# EAGLE design control_board (EAGLE 6.6.0)
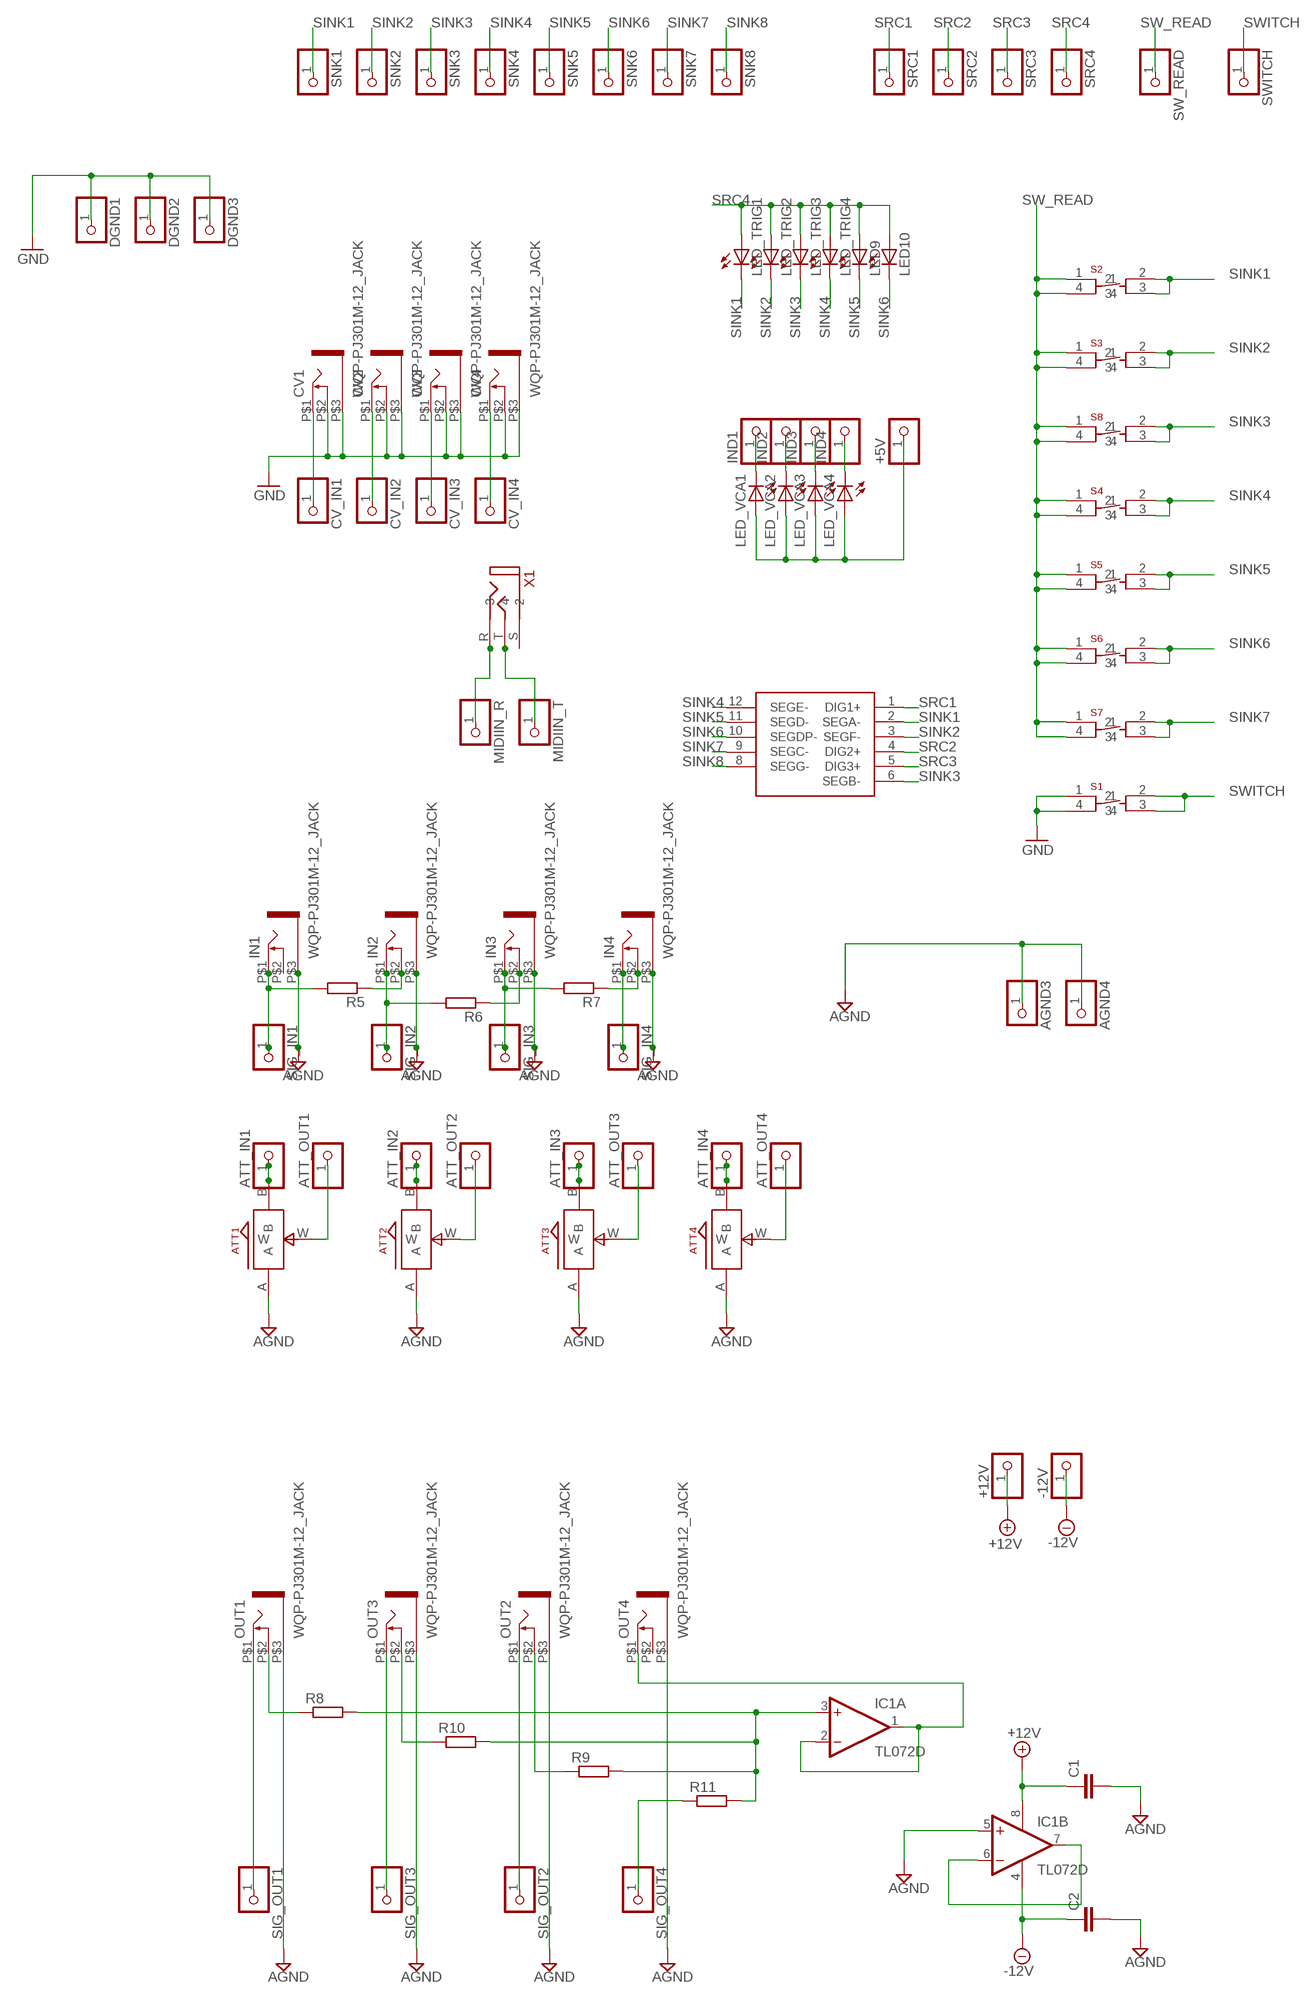
[diagram p0: schematic, sheet 1]

## Parts
+5V  PINHD-1X1  [1X01]
+12V  PINHD-1X1  [1X01]
-12V  PINHD-1X1  [1X01]
AGND3  PINHD-1X1  [1X01]
AGND4  PINHD-1X1  [1X01]
ATT1  ALPS_POT_SMALL  [SMALL_ALPS_POT]
ATT2  ALPS_POT_SMALL  [SMALL_ALPS_POT]
ATT3  ALPS_POT_SMALL  [SMALL_ALPS_POT]
ATT4  ALPS_POT_SMALL  [SMALL_ALPS_POT]
ATT_IN1  PINHD-1X1  [1X01]
ATT_IN2  PINHD-1X1  [1X01]
ATT_IN3  PINHD-1X1  [1X01]
ATT_IN4  PINHD-1X1  [1X01]
ATT_OUT1  PINHD-1X1  [1X01]
ATT_OUT2  PINHD-1X1  [1X01]
ATT_OUT3  PINHD-1X1  [1X01]
ATT_OUT4  PINHD-1X1  [1X01]
C1  C-EUC0805  [C0805]
C2  C-EUC0805  [C0805]
CV1  WQP-PJ301M-12_JACK  [WQP-PJ301M-12_JACK]
CV2  WQP-PJ301M-12_JACK  [WQP-PJ301M-12_JACK]
CV3  WQP-PJ301M-12_JACK  [WQP-PJ301M-12_JACK]
CV4  WQP-PJ301M-12_JACK  [WQP-PJ301M-12_JACK]
CV_IN1  PINHD-1X1  [1X01]
CV_IN2  PINHD-1X1  [1X01]
CV_IN3  PINHD-1X1  [1X01]
CV_IN4  PINHD-1X1  [1X01]
DGND1  PINHD-1X1  [1X01]
DGND2  PINHD-1X1  [1X01]
DGND3  PINHD-1X1  [1X01]
DISP1  KYX2381_TRIPLE7SEG  [KYX2381_TRIPLE7SEG]
IC1  TL072D  [SO08]
IN1  WQP-PJ301M-12_JACK  [WQP-PJ301M-12_JACK]
IN2  WQP-PJ301M-12_JACK  [WQP-PJ301M-12_JACK]
IN3  WQP-PJ301M-12_JACK  [WQP-PJ301M-12_JACK]
IN4  WQP-PJ301M-12_JACK  [WQP-PJ301M-12_JACK]
IND1  PINHD-1X1  [1X01]
IND2  PINHD-1X1  [1X01]
IND3  PINHD-1X1  [1X01]
IND4  PINHD-1X1  [1X01]
LED9  LED3MM  [LED3MM]
LED10  LED3MM  [LED3MM]
LED_TRIG1  LED3MM  [LED3MM]
LED_TRIG2  LED3MM  [LED3MM]
LED_TRIG3  LED3MM  [LED3MM]
LED_TRIG4  LED3MM  [LED3MM]
LED_VCA1  LED3MM  [LED3MM]
LED_VCA2  LED3MM  [LED3MM]
LED_VCA3  LED3MM  [LED3MM]
LED_VCA4  LED3MM  [LED3MM]
MIDIIN_R  PINHD-1X1  [1X01]
MIDIIN_T  PINHD-1X1  [1X01]
OUT1  WQP-PJ301M-12_JACK  [WQP-PJ301M-12_JACK]
OUT2  WQP-PJ301M-12_JACK  [WQP-PJ301M-12_JACK]
OUT3  WQP-PJ301M-12_JACK  [WQP-PJ301M-12_JACK]
OUT4  WQP-PJ301M-12_JACK  [WQP-PJ301M-12_JACK]
R5  R-EU_R0805  [R0805]
R6  R-EU_R0805  [R0805]
R7  R-EU_R0805  [R0805]
R8  R-EU_R0805  [R0805]
R9  R-EU_R0805  [R0805]
R10  R-EU_R0805  [R0805]
R11  R-EU_R0805  [R0805]
S1  6MM_TACT  [6MMTACT]
S2  6MM_TACT  [6MMTACT]
S3  6MM_TACT  [6MMTACT]
S4  6MM_TACT  [6MMTACT]
S5  6MM_TACT  [6MMTACT]
S6  6MM_TACT  [6MMTACT]
S7  6MM_TACT  [6MMTACT]
S8  6MM_TACT  [6MMTACT]
SIG_IN1  PINHD-1X1  [1X01]
SIG_IN2  PINHD-1X1  [1X01]
SIG_IN3  PINHD-1X1  [1X01]
SIG_IN4  PINHD-1X1  [1X01]
SIG_OUT1  PINHD-1X1  [1X01]
SIG_OUT2  PINHD-1X1  [1X01]
SIG_OUT3  PINHD-1X1  [1X01]
SIG_OUT4  PINHD-1X1  [1X01]
SNK1  PINHD-1X1  [1X01]
SNK2  PINHD-1X1  [1X01]
SNK3  PINHD-1X1  [1X01]
SNK4  PINHD-1X1  [1X01]
SNK5  PINHD-1X1  [1X01]
SNK6  PINHD-1X1  [1X01]
SNK7  PINHD-1X1  [1X01]
SNK8  PINHD-1X1  [1X01]
SRC1  PINHD-1X1  [1X01]
SRC2  PINHD-1X1  [1X01]
SRC3  PINHD-1X1  [1X01]
SRC4  PINHD-1X1  [1X01]
SW_READ  PINHD-1X1  [1X01]
SWITCH  PINHD-1X1  [1X01]
X1  VERTICAL_3_5MM_SOCKETTHONK  [PJ301CM]

## Nets
+5V: +5V.1 LED_VCA1.A LED_VCA2.A LED_VCA3.A LED_VCA4.A
+12V: +12V.1 C1.1 IC1.8(P:V+)
-12V: -12V.1 C2.1 IC1.4(P:V-)
AGND: AGND3.1 AGND4.1 ATT1.A ATT2.A ATT3.A ATT4.A C1.2 C2.2 IC1.5(B:+IN) IN1.P$3 IN2.P$3 IN3.P$3 IN4.P$3 OUT1.P$3 OUT2.P$3 OUT3.P$3 OUT4.P$3
GND: CV1.P$2 CV1.P$3 CV2.P$2 CV2.P$3 CV3.P$2 CV3.P$3 CV4.P$2 CV4.P$3 DGND1.1 DGND2.1 DGND3.1 S1.1 S1.4
N$1: ATT1.W ATT_OUT1.1
N$2: ATT1.B ATT_IN1.1
N$3: ATT3.W ATT_OUT3.1
N$4: ATT2.B ATT_IN2.1
N$5: ATT2.W ATT_OUT2.1
N$6: ATT3.B ATT_IN3.1
N$7: ATT4.W ATT_OUT4.1
N$8: ATT4.B ATT_IN4.1
N$9: OUT1.P$2 R8.1
N$10: IN2.P$1 R6.2 SIG_IN2.1
N$11: IN3.P$1 R7.2 SIG_IN3.1
N$12: IN4.P$1 SIG_IN4.1
N$13: CV1.P$1 CV_IN1.1
N$14: CV2.P$1 CV_IN2.1
N$15: CV3.P$1 CV_IN3.1
N$16: CV4.P$1 CV_IN4.1
N$18: OUT1.P$1 SIG_OUT1.1
N$19: MIDIIN_R.1 X1.R
N$20: MIDIIN_T.1 X1.T
N$21: IND1.1 LED_VCA1.K(C)
N$22: IND2.1 LED_VCA2.K(C)
N$23: IND3.1 LED_VCA3.K(C)
N$24: IND4.1 LED_VCA4.K(C)
N$26: OUT3.P$1 SIG_OUT3.1
N$27: OUT2.P$1 SIG_OUT2.1
N$28: R11.1 SIG_OUT4.1
N$34: IN2.P$2 R5.1
N$35: IN3.P$2 R6.1
N$36: IN4.P$2 R7.1
N$37: IN1.P$1 R5.2 SIG_IN1.1
N$38: OUT3.P$2 R10.1
N$39: OUT2.P$2 R9.1
N$42: IC1.3(A:+IN) R8.2 R9.2 R10.2 R11.2
N$44: IC1.1(A:OUT) IC1.2(A:-IN) OUT4.P$1
N$46: IC1.6(B:-IN) IC1.7(B:OUT)
SINK1: DISP1.2(SEGA-) LED_TRIG1.K(C) S2.2 S2.3 SNK1.1
SINK2: DISP1.3(SEGF-) LED_TRIG2.K(C) S3.2 S3.3 SNK2.1
SINK3: DISP1.6(SEGB-) LED_TRIG3.K(C) S8.2 S8.3 SNK3.1
SINK4: DISP1.12(SEGE-) LED_TRIG4.K(C) S4.2 S4.3 SNK4.1
SINK5: DISP1.11(SEGD-) LED9.K(C) S5.2 S5.3 SNK5.1
SINK6: DISP1.10(SEGDP-) LED10.K(C) S6.2 S6.3 SNK6.1
SINK7: DISP1.9(SEGC-) S7.2 S7.3 SNK7.1
SINK8: DISP1.8(SEGG-) SNK8.1
SRC1: DISP1.1(DIG1+) SRC1.1
SRC2: DISP1.4(DIG2+) SRC2.1
SRC3: DISP1.5(DIG3+) SRC3.1
SRC4: LED9.A LED10.A LED_TRIG1.A LED_TRIG2.A LED_TRIG3.A LED_TRIG4.A SRC4.1
SW_READ: S2.1 S2.4 S3.1 S3.4 S4.1 S4.4 S5.1 S5.4 S6.1 S6.4 S7.1 S7.4 S8.1 S8.4 SW_READ.1
SWITCH: S1.2 S1.3 SWITCH.1
Unconnected: IN1.P$2 OUT4.P$2 X1.S

## Library data of the parts
+5V +12V -12V AGND3 AGND4 ATT_IN1-ATT_IN4 ATT_OUT1-ATT_OUT4 CV_IN1-CV_IN4 DGND1-DGND3 IND1-IND4 MIDIIN_R MIDIIN_T SIG_IN1-SIG_IN4 SIG_OUT1-SIG_OUT4 SNK1-SNK8 SRC1-SRC4 SW_READ SWITCH = pinhead:PINHD-1X1: PIN HEADER
ATT1-ATT4 = jasons_stuff:ALPS_POT_SMALL
C1 C2 = rcl:C-EU: CAPACITOR, European symbol
CV1-CV4 IN1-IN4 OUT1-OUT4 = thonkiconn:WQP-PJ301M-12_JACK
DISP1 = jason_eagle6:KYX2381_TRIPLE7SEG
IC1 = linear:TL072: OP AMP
LED9 LED10 LED_TRIG1-LED_TRIG4 LED_VCA1-LED_VCA4 = led:LED: LED OSRAM: - CHIPLED LG R971, LG N971, LY N971, LG Q971, LY Q971, LO R971, LY R971 LH N974, LH R974 LS Q976, LO Q976, LY Q976 LO Q996 - Hyper CHIPLED LW Q18S LB Q993, LB Q99A, LB R99A - SideLED LS A670, LO A670, LY A670, LG A670, LP A670 LB A673, LV A673, LT A673, LW A673 LH A674 LY A675 LS A676, LA A676, LO A676, LY A676, LW A676 LS A679, LY A679, LG A679 - Hyper Micro SIDELED® LS Y876, LA Y876, LO Y876, LY Y876 LT Y87S - SmartLED LW L88C, LW L88S LB L89C, LB L89S, LG L890 LS L89K, LO L89K, LY L89K LS L896, LA L896, LO L896, LY L896 - TOPLED LS T670, LO T670, LY T670, LG T670, LP T670 LSG T670, LSP T670, LSY T670, LOP T670, LYG T670 LG T671, LOG T671, LSG T671 LB T673, LV T673, LT T673, LW T673 LH T674 LS T676, LA T676, LO T676, LY T676, LB T676, LH T676, LSB T676, LW T676 LB T67C, LV T67C, LT T67C, LS T67K, LO T67K, LY T67K, LW E67C LS E67B, LA E67B, LO E67B, LY E67B, LB E67C, LV E67C, LT E67C LW T67C LS T679, LY T679, LG T679 LS T770, LO T770, LY T770, LG T770, LP T770 LB T773, LV T773, LT T773, LW T773 LH T774 LS E675, LA E675, LY E675, LS T675 LS T776, LA T776, LO T776, LY T776, LB T776 LHGB T686 LT T68C, LB T68C - Hyper Mini TOPLED® LB M676 - Mini TOPLED Santana® LG M470 LS M47K, LO M47K, LY M47K Source: http://www.osram.convergy.de LUXEON: - LUMILED® LXK2-PW12-R00, LXK2-PW12-S00, LXK2-PW14-U00, LXK2-PW14-V00 LXK2-PM12-R00, LXK2-PM12-S00, LXK2-PM14-U00 LXK2-PE12-Q00, LXK2-PE12-R00, LXK2-PE12-S00, LXK2-PE14-T00, LXK2-PE14-U00 LXK2-PB12-K00, LXK2-PB12-L00, LXK2-PB12-M00, LXK2-PB14-N00, LXK2-PB14-P00, LXK2-PB14-Q00 LXK2-PR12-L00, LXK2-PR12-M00, LXK2-PR14-Q00, LXK2-PR14-R00 LXK2-PD12-Q00, LXK2-PD12-R00, LXK2-PD12-S00 LXK2-PH12-R00, LXK2-PH12-S00 LXK2-PL12-P00, LXK2-PL12-Q00, LXK2-PL12-R00 Source: www.luxeon.com KINGBRIGHT: KA-3528ASYC Source: www.kingbright.com
R5-R11 = rcl:R-EU_: RESISTOR, European symbol
S1-S8 = jason_eagle6:6MM_TACT
X1 = jason_eagle6:VERTICAL_3_5MM_SOCKET

## Board
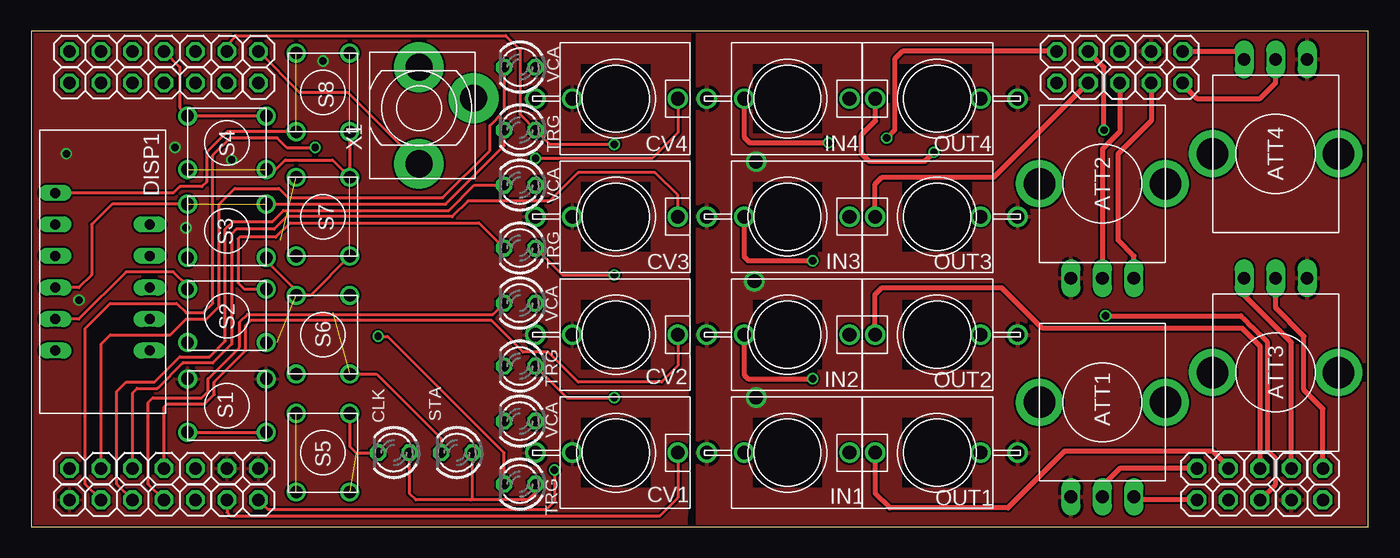
[diagram p1: board, top side]
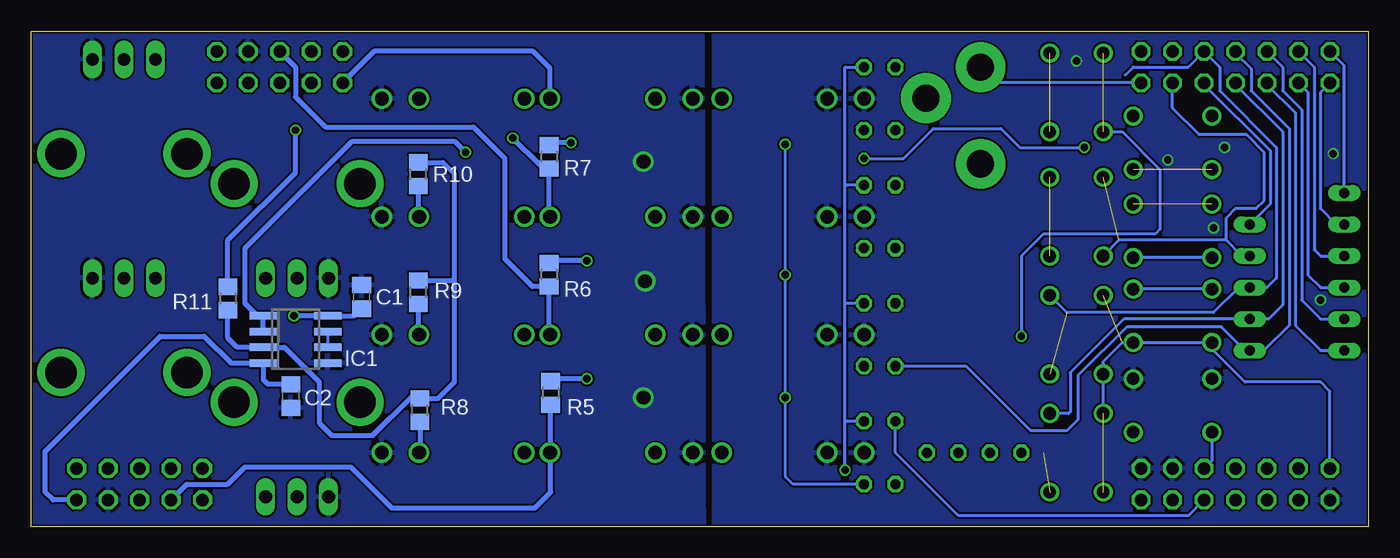
[diagram p2: board, bottom side, seen from below]

Size 107.84 x 39.98 mm. Coordinates in mm from the lower left corner, seen from the top.
Outline: 107.84,0 107.84,39.98 0,39.98 0,0 107.84,0
Copper layers (1*16): Top 0.035mm / dielectric 1.5mm / Bottom 0.035mm
Design rules "hackvana": minimum track width 6mil, minimum drill 0.3mm, track to track 6mil, track to pad 9mil, pad to pad 6mil, via to via 6mil, smd to smd 0mil, copper to edge 6mil, drill to drill 6mil, minimum pad ring 10mil, minimum via ring 6mil, stop-mask expansion 2mil, vias tented up to drill 100mil, thermal gap 10mil

### Footprints (pad centres in the part's own frame; a part is rotated, then mirrored left to right if it is on the bottom)
1X01 = drill 1.016 octagon: 1 0,0
SMALL_ALPS_POT = drill 1.016 long: A -2.54,-7.62; B 2.54,-7.62; W 0,-7.62 | drill 2.54 pad 3.81: GND@1 -5.08,0; GND@2 5.08,0
C0805 = smd 1.3 x 1.5: 1 -0.95,0; 2 0.95,0
WQP-PJ301M-12_JACK = drill 1.1: P$1 0,5; P$2 0,-3.5; P$3 0,-6.5
KYX2381_TRIPLE7SEG = drill 0.8 long: 1 5.08,8.89; 2 7.62,8.89; 3 10.16,8.89; 4 12.7,8.89; 5 15.24,8.89; 6 17.78,8.89; 8 15.24,1.27; 9 12.7,1.27; 10 10.16,1.27; 11 7.62,1.27; 12 5.08,1.27
SO08 = smd 0.6 x 2.2: 1 -1.905,-2.6; 2 -0.635,-2.6; 3 0.635,-2.6; 4 1.905,-2.6; 5 1.905,2.6; 6 0.635,2.6; 7 -0.635,2.6; 8 -1.905,2.6
LED3MM = drill 0.813 octagon: A -1.27,0; K 1.27,0
R0805 = smd 1.3 x 1.5: 1 -0.95,0; 2 0.95,0
6MMTACT = drill 1.016: 1 -3.175,2.159; 2 -3.175,-2.159; 3 3.175,-2.159; 4 3.175,2.159
PJ301CM = drill 2.2 pad 4: R 0,3.3; S 4.4,0.8; T 0,-4.5

### Placement (x,y rotation side)
+5V  18.31,2.16 0 top
+12V  99.08,2.16 0 top
-12V  104.16,2.16 0 top
AGND3  90.32,38.35 90 top
AGND4  101.62,2.16 90 top
ATT1  86.38,10.03 0 top
ATT2  86.38,27.69 0 top
ATT3  100.35,12.45 180 top
ATT4  100.35,30.1 180 top
ATT_IN1  94,2.16 90 top
ATT_IN2  90.32,35.81 90 top
ATT_IN3  101.62,4.7 90 top
ATT_IN4  92.86,38.35 90 top
ATT_OUT1  94,4.7 90 top
ATT_OUT2  87.78,35.81 90 top
ATT_OUT3  104.16,4.7 90 top
ATT_OUT4  92.86,35.81 90 top
C1  81.17,18.54 90 bottom
C2  86.89,10.54 270 bottom
CV1  47.14,5.97 270 top
CV2  47.14,15.49 270 top
CV3  47.14,25.02 270 top
CV4  47.14,34.54 270 top
CV_IN1  15.77,2.16 90 top
CV_IN2  10.69,4.7 90 top
CV_IN3  8.15,4.7 90 top
CV_IN4  5.61,2.16 90 top
DGND1  18.31,4.7 0 top
DGND2  3.07,2.16 0 top
DGND3  15.77,4.7 0 top
DISP1  10.81,9.14 90 top
IC1  86.51,15.11 270 bottom
IN1  60.98,5.97 270 top
IN2  60.98,15.49 270 top
IN3  60.98,25.02 270 top
IN4  60.98,34.54 270 top
IND1  13.23,2.16 0 top
IND2  10.69,2.16 0 top
IND3  8.15,2.16 0 top
IND4  5.61,4.7 0 top
LED9  29.23,5.97 180 top
LED10  34.31,5.97 180 top
LED_TRIG1  39.39,22.48 180 top
LED_TRIG2  39.39,32 180 top
LED_TRIG3  39.39,3.43 180 top
LED_TRIG4  39.39,12.95 180 top
LED_VCA1  39.39,8.51 180 top
LED_VCA2  39.39,18.03 180 top
LED_VCA3  39.39,27.56 180 top
LED_VCA4  39.39,37.08 180 top
MIDIIN_R  18.31,35.81 90 top
MIDIIN_T  18.31,38.35 90 top
OUT1  73.04,5.97 90 top
OUT2  73.04,15.49 90 top
OUT3  73.04,25.02 90 top
OUT4  73.04,34.54 90 top
R5  65.93,10.8 270 bottom
R6  66.06,20.32 270 bottom
R7  66.06,29.84 270 bottom
R8  76.47,9.4 90 bottom
R9  76.6,18.92 90 bottom
R10  76.6,28.45 90 bottom
R11  91.97,18.41 270 bottom
S1  15.77,9.78 0 top
S2  15.77,17.02 180 top
S3  15.77,23.88 180 top
S4  15.77,30.99 180 top
S5  23.51,5.97 90 top
S6  23.51,15.49 90 top
S7  23.51,25.02 270 top
S8  23.51,35.05 270 top
SIG_IN1  96.54,2.16 270 top
SIG_IN2  87.78,38.35 270 top
SIG_IN3  82.7,38.35 90 top
SIG_IN4  82.7,35.81 90 top
SIG_OUT1  96.54,4.7 90 top
SIG_OUT2  99.08,4.7 90 top
SIG_OUT3  85.24,35.81 90 top
SIG_OUT4  85.24,38.35 0 top
SNK1  8.15,38.35 0 top
SNK2  5.61,35.81 0 top
SNK3  3.07,38.35 0 top
SNK4  10.69,38.35 0 top
SNK5  10.69,35.81 0 top
SNK6  13.23,38.35 0 top
SNK7  15.77,35.81 0 top
SNK8  13.23,35.81 0 top
SRC1  8.15,35.81 0 top
SRC2  5.61,38.35 0 top
SRC3  3.07,35.81 0 top
SRC4  15.77,38.35 0 top
SW_READ  3.07,4.7 0 top
SWITCH  13.23,4.7 0 top
X1  31.26,33.78 0 top

### Tracks (layer width: path | path; a pad name or v marks a point on that pad's centre or on a via)
+5V  (via drill 0.6)
  Top 0.254: v42.18,4.57 42.18,2.03 41.55,1.4 19.07,1.4 +5V.1
  Bottom 0.254: LED_VCA1.A 42.06,8.51 42.18,8.38 | 42.18,8.38 42.18,18.03 | 42.18,18.03 42.18,27.69 | 42.18,27.69 42.18,37.08 LED_VCA4.A | LED_VCA3.A 42.06,27.56 42.18,27.69 | LED_VCA2.A 42.18,18.03 | v42.18,4.57 42.18,8.38
+12V  (via drill 0.6 pad 0.61)
  Top 0.406: +12V.1 100.35,3.43 100.35,5.46 99.71,6.1 99.71,14.86 98.44,16.13 97.81,16.76 97.55,17.02 v86.63,17.02
  Bottom 0.406: C1.1 81.75,17.02 IC1.8 v86.63,17.02
-12V
  Bottom 0.406: C2.1 88.73,11.49 89.11,11.87 IC1.4 91.71,13.21 93.87,15.37 97.43,15.37 106.7,6.1 106.7,2.79 106.06,2.16 -12V.1
AGND  (via drill 1.1)
  other vias: 58.44,29.46 58.31,19.81 58.44,10.41
  pour Bottom: 53.74,42.29 53.61,-6.6 109.24,-4.83 109.24,42.16
  pour Top: 53.74,40.77 53.74,-4.95 113.05,-4.83 113.05,45.97 55.9,45.97
GND  (via drill 0.6)
  other vias: 23.51,37.59 16.15,29.59 11.58,30.61 2.81,30.1 12.46,24.13 3.83,18.29
  pour Bottom: -4.55,42.8 -4.55,-2.29 52.72,-2.29 52.72,42.8
  pour Top: -5.06,42.16 -5.06,-2.29 52.85,-2.29 53.1,42.29 -4.81,42.29
N$1
  Top 0.406: ATT_OUT1.1 87.78,4.7 86.38,3.3 ATT1.W
N$2
  Top 0.406: ATT_IN1.1 89.17,2.16 ATT1.B
N$3
  Top 0.406: ATT_OUT3.1 104.16,9.52 102.63,11.05 102.63,15.37 100.35,17.65 ATT3.W
N$4
  Top 0.406: ATT2.B 88.92,21.84 87.65,23.11 87.65,30.1 90.32,32.77 ATT_IN2.1
N$5
  Top 0.406: ATT_OUT2.1 87.78,31.88 86.38,30.48 ATT2.W
N$6
  Top 0.406: ATT_IN3.1 101.62,14.86 97.81,18.67 ATT3.B
N$7
  Top 0.406: ATT_OUT4.1 92.86,35.69 94,34.54 99.08,34.54 100.35,35.81 ATT4.W
N$8
  Top 0.406: ATT_IN4.1 97.17,38.35 ATT4.B
N$9
  Bottom 0.406: R8.1 76.47,6.04 OUT1.P$2
N$10
  Bottom 0.406: SIG_IN2.1 86.51,37.08 86.51,34.67 84.09,32.26 72.15,32.26 69.61,29.72 69.61,21.59 67.39,19.37 R6.2 66.06,15.49 IN2.P$1
N$11  (via drill 0.6 pad 0.61)
  Top 0.406: SIG_IN3.1 70.25,38.35 69.61,37.72 69.61,32 v68.98,31.37
  Bottom 0.406: IN3.P$1 66.06,25.02 R7.2 66.37,29.21 66.82,29.21 v68.98,31.37
N$12
  Bottom 0.406: IN4.P$1 65.98,37 67.33,38.35 80.16,38.35 SIG_IN4.1
N$13
  Top 0.254: CV_IN1.1 15.77,1.14 16.02,0.89 50.69,0.89 52.14,2.33 CV1.P$1
N$14
  Top 0.254: CV_IN2.1 10.69,9.65 10.94,9.91 13.99,9.91 14.75,10.67 14.75,11.68 17.29,14.22 17.29,16.26 17.67,16.64 37.1,16.64 39.64,14.1 41.67,14.1 44.09,11.68 50.82,11.68 52.14,13 CV2.P$1
N$15
  Top 0.254: CV_IN3.1 8.15,10.8 8.53,11.18 10.18,11.18 12.21,13.21 14.62,13.21 16.15,14.73 16.15,23.62 16.53,24 19.58,24 20.59,25.02 33.93,25.02 35.2,26.29 41.8,26.29 44.09,28.57 50.31,28.57 52.14,26.75 CV3.P$1
N$16  (via drill 0.6)
  Top 0.254: CV_IN4.1 4.34,3.43 4.34,16 6.37,18.03 11.7,18.03 12.46,17.27 13.86,17.27 14.62,18.03 14.62,29.97 16.02,31.37 19.83,31.37 20.59,30.61 v22.88,30.61 | CV4.P$1 52.14,31.8 50.06,29.72 v40.66,29.72
  Bottom 0.254: v22.88,30.61 28.09,30.61 29.61,32.13 35.07,32.13 37.48,29.72 v40.66,29.72
N$18
  Top 0.406: SIG_OUT1.1 96.54,4.83 95.27,6.1 83.33,6.1 78.76,1.52 69.23,1.52 68.04,2.71 OUT1.P$1
N$19
  Bottom 0.254: MIDIIN_R.1 29.99,35.81 X1.R
N$20
  Top 0.254: MIDIIN_T.1 21.61,35.05 25.49,35.05 X1.T
N$21
  Bottom 0.254: IND1.1 14.5,0.89 33.04,0.89 38.12,5.97 LED_VCA1.K
N$22
  Top 0.254: IND2.1 9.42,3.43 9.42,10.03 9.8,10.41 13.73,10.41 14.24,10.92 14.24,11.94 16.78,14.48 16.78,16.51 17.42,17.14 37.23,17.14 LED_VCA2.K
N$23
  Top 0.254: IND3.1 6.88,3.43 6.88,10.92 7.64,11.68 9.92,11.68 11.96,13.72 14.37,13.72 15.64,14.99 15.64,24 16.27,24.64 19.45,24.64 20.34,25.53 33.67,25.53 35.71,27.56 LED_VCA3.K
N$24
  Top 0.254: IND4.1 5.61,14.73 6.37,15.49 11.19,15.49 12.46,16.76 14.12,16.76 15.13,17.78 15.13,26.03 16.4,27.3 19.96,27.3 20.72,26.54 33.17,26.54 36.98,30.35 36.98,32.39 38.12,33.53 LED_VCA4.K
N$26
  Top 0.406: OUT3.P$1 68.04,27.64 68.6,28.19 77.62,28.19 SIG_OUT3.1
N$27
  Top 0.406: OUT2.P$1 68.04,18.75 68.6,19.3 78.25,19.3 81.55,16 97.68,16 99.08,14.6 SIG_OUT2.1
N$28  (via drill 0.6 pad 0.61)
  Top 0.406: v86.51,32 86.51,37.08 SIG_OUT4.1
  Bottom 0.406: R11.1 91.97,23.11 86.51,28.57 v86.51,32
N$34  (via drill 0.6)
  Top 0.406: IN2.P$2 57.48,12.26 57.8,11.94 v63.01,11.94
  Bottom 0.406: v63.01,11.94 65.74,11.94 R5.1
N$35  (via drill 0.6)
  Top 0.406: IN3.P$2 57.48,21.79 57.8,21.46 v63.01,21.46
  Bottom 0.406: v63.01,21.46 65.87,21.46 R6.1
N$36  (via drill 0.6 pad 0.61)
  Top 0.406: IN4.P$2 57.48,31.44 57.93,30.99 v64.28,30.99
  Bottom 0.406: 65.74,31.11 R7.1 65.87,30.99 v64.28,30.99
N$37
  Bottom 0.406: SIG_IN1.1 95.27,3.43 91.97,3.43 90.57,4.83 82.06,4.83 78.76,1.52 67.2,1.52 65.93,2.79 65.93,5.92 IN1.P$1 65.93,5.97 R5.2
N$38
  Bottom 0.406: R10.1 76.6,25.07 OUT3.P$2
N$39
  Bottom 0.406: R9.1 76.6,15.55 OUT2.P$2
N$42
  Bottom 0.406: R11.2 91.97,15.24 91.2,14.48 IC1.3 87.39,14.48 84.6,11.68 84.6,8.38 83.58,7.37 80.28,7.37 77.23,10.41 76.54,10.41 R8.2 75.01,10.35 73.68,11.68 73.68,19.81 | 73.68,19.81 73.68,28.45 74.63,29.4 R10.2 | R9.2 73.74,19.87 73.68,19.81
N$44  (via drill 0.6 pad 0.61)
  Top 0.406: v72.79,30.23 72.03,29.46 67.58,29.46 66.95,30.1 66.95,31.62 68.09,32.77 68.09,34.5 OUT4.P$1
  Bottom 0.406: IC1.2 IC1.1 89.55,17.02 90.57,18.03 90.57,22.48 81.93,31.11 73.68,31.11 v72.79,30.23
N$46
  Bottom 0.254: IC1.7 IC1.6
SINK1
  Top 0.254: DISP1.2 3.83,16.76 7.64,20.57 11.45,20.57 12.59,19.43 S2.3 | S2.2 17.16,19.18 16.66,19.68 16.66,23.24 16.78,23.37 19.7,23.37 20.85,24.51 36.09,24.51 LED_TRIG1.K
  Bottom 0.254: SNK1.1 6.88,37.08 6.88,35.18 5.35,33.66 5.35,18.29 3.83,16.76 DISP1.2 | S2.3 S2.2
SINK2  (1 unrouted)
  Top 0.254: S3.3 6.5,26.03 4.84,24.38 4.84,20.32 3.83,19.3 DISP1.3 | S3.2 33.42,26.03 38.12,30.73 LED_TRIG2.K
  Bottom 0.254: SNK2.1 4.84,35.05 4.84,20.32 3.83,19.3 DISP1.3
SINK3  (via drill 0.6)  (1 unrouted)
  Top 0.254: S8.3 15.77,31.88 14.12,30.23 14.12,27.81 13.73,27.43 11.96,27.43 11.45,26.92 DISP1.6 | v27.96,15.37 28.72,15.37 38.12,5.97 LED_TRIG3.K
  Bottom 0.254: DISP1.6 1.92,37.21 SNK3.1 | S8.3 19.83,31.88 16.78,28.83 16.78,24 17.16,23.62 26.18,23.62 27.96,21.84 v27.96,15.37
SINK4
  Top 0.254: SNK4.1 11.96,37.08 11.96,33.78 S4.3 | S4.3 12.72,33.27 | S4.2 S4.3
  Bottom 0.254: 19.07,33.27 S4.2 | SNK4.1 10.69,38.23 9.42,36.96 9.42,35.18 6.37,32.13 6.37,16.26 8.4,14.22 DISP1.12 9.92,14.22 11.83,16.13 19.45,16.13 23.39,12.19 23.39,8.64 24.28,7.75 27.2,7.75 32.4,12.95 LED_TRIG4.K
SINK5  (1 unrouted)
  Top 0.254: S5.3 25.67,6.48 26.18,5.97 LED9.K
  Bottom 0.254: SNK5.1 10.69,35.69 6.88,31.88 6.88,17.91 8.02,16.76 DISP1.11 19.7,16.76 24.02,12.45 24.02,9.27 24.15,9.14 S5.3
SINK6  (1 unrouted)
  Top 0.254: S6.2 27.83,12.32 33.04,7.11 LED10.K
  Bottom 0.254: 19.58,36.45 18.94,37.08 14.5,37.08 SNK6.1 11.96,37.08 11.96,35.18 7.38,30.61 7.38,20.07 8.15,19.3 DISP1.10 10.43,19.3 12.46,17.27 24.28,17.27 S6.3
SINK7  (1 unrouted)
  Bottom 0.254: 11.45,23.11 11.45,24.89 10.69,25.65 9.04,25.65 8.4,26.29 8.4,30.23 9.8,31.62 13.61,31.62 15.77,33.78 SNK7.1 | DISP1.9 10.18,21.84 11.45,23.11 | 11.45,23.11 20.08,23.11 S7.3
SINK8
  Bottom 0.254: SNK8.1 13.23,35.69 7.89,30.35 7.89,26.03 DISP1.8
SRC1
  Bottom 0.254: SRC1.1 8.15,35.69 5.86,33.4 5.86,16.26 3.83,14.22 DISP1.1
SRC2
  Bottom 0.254: SRC2.1 4.34,37.08 4.34,22.35 3.83,21.84 DISP1.4
SRC3
  Bottom 0.254: DISP1.5 2.56,24.38 3.83,25.65 3.83,35.05 SRC3.1
SRC4  (via drill 0.6)
  Top 0.254: SRC4.1 15.77,38.86 16.53,39.62 38.25,39.62 39.39,38.48 39.39,33.27 LED_TRIG2.A 41.8,30.86 v47.01,30.86 | LED_TRIG4.A 43.2,10.41 v47.01,10.41 | LED_TRIG1.A 42.82,20.32 v47.01,20.32 | LED10.A 35.58,2.29 35.45,2.16 | 35.45,2.16 40.02,2.16 40.66,2.79 LED_TRIG3.A | 35.45,2.16 31.01,2.16 30.5,2.67 LED9.A
  Bottom 0.254: v47.01,30.86 v47.01,20.32 v47.01,10.41 47.01,4.06 46.37,3.43 LED_TRIG3.A
SW_READ  (5 unrouted)
  Top 0.254: S3.1 18.94,21.46 21.35,19.05 S6.4 22.5,18.67 S7.4 | S8.4 S7.1 24.28,29.59 20.47,29.59 19.7,28.83 S4.1
  Bottom 0.254: S5.4 S6.1 21.35,13.34 19.83,14.86 S2.1 S2.4 12.59,14.35 9.92,11.68 3.83,11.68 3.07,10.92 SW_READ.1 | S3.4 S3.1
SWITCH
  Top 0.254: S1.2 S1.3
  Bottom 0.254: S1.2 12.59,5.33 SWITCH.1

### Text on the board
tPlace: VCA | TRG | VCA | TRG | VCA | TRG | VCA | STA | CLK | TRG
bDocu: hotchk155 | CONTROL BOARD V1 | CONTROL BOARD V2 | DIGITALLY CONTROLLED QUAD VCA/MIXER